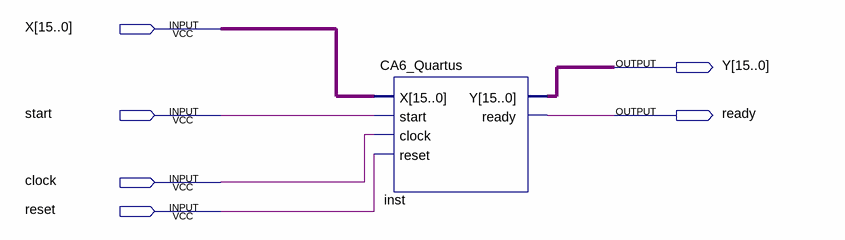
[diagram p0: schematic sheet]
// Quartus schematic Tanh_Q.bdf as structural Verilog: 1 symbols, 6 pins
module Tanh_Q (
  input  [15:0] X,
  input  start,
  input  clock,
  input  reset,
  output [15:0] Y,
  output ready
);

  CA6_Quartus inst (.X(X), .start(start), .clock(clock), .reset(reset), .Y(Y), .ready(ready));
endmodule
